# Altium schematic sheet NewPCBMC.SchDoc
size 381 x 241 mm; SheetNumber: 1; SheetTotal: 1
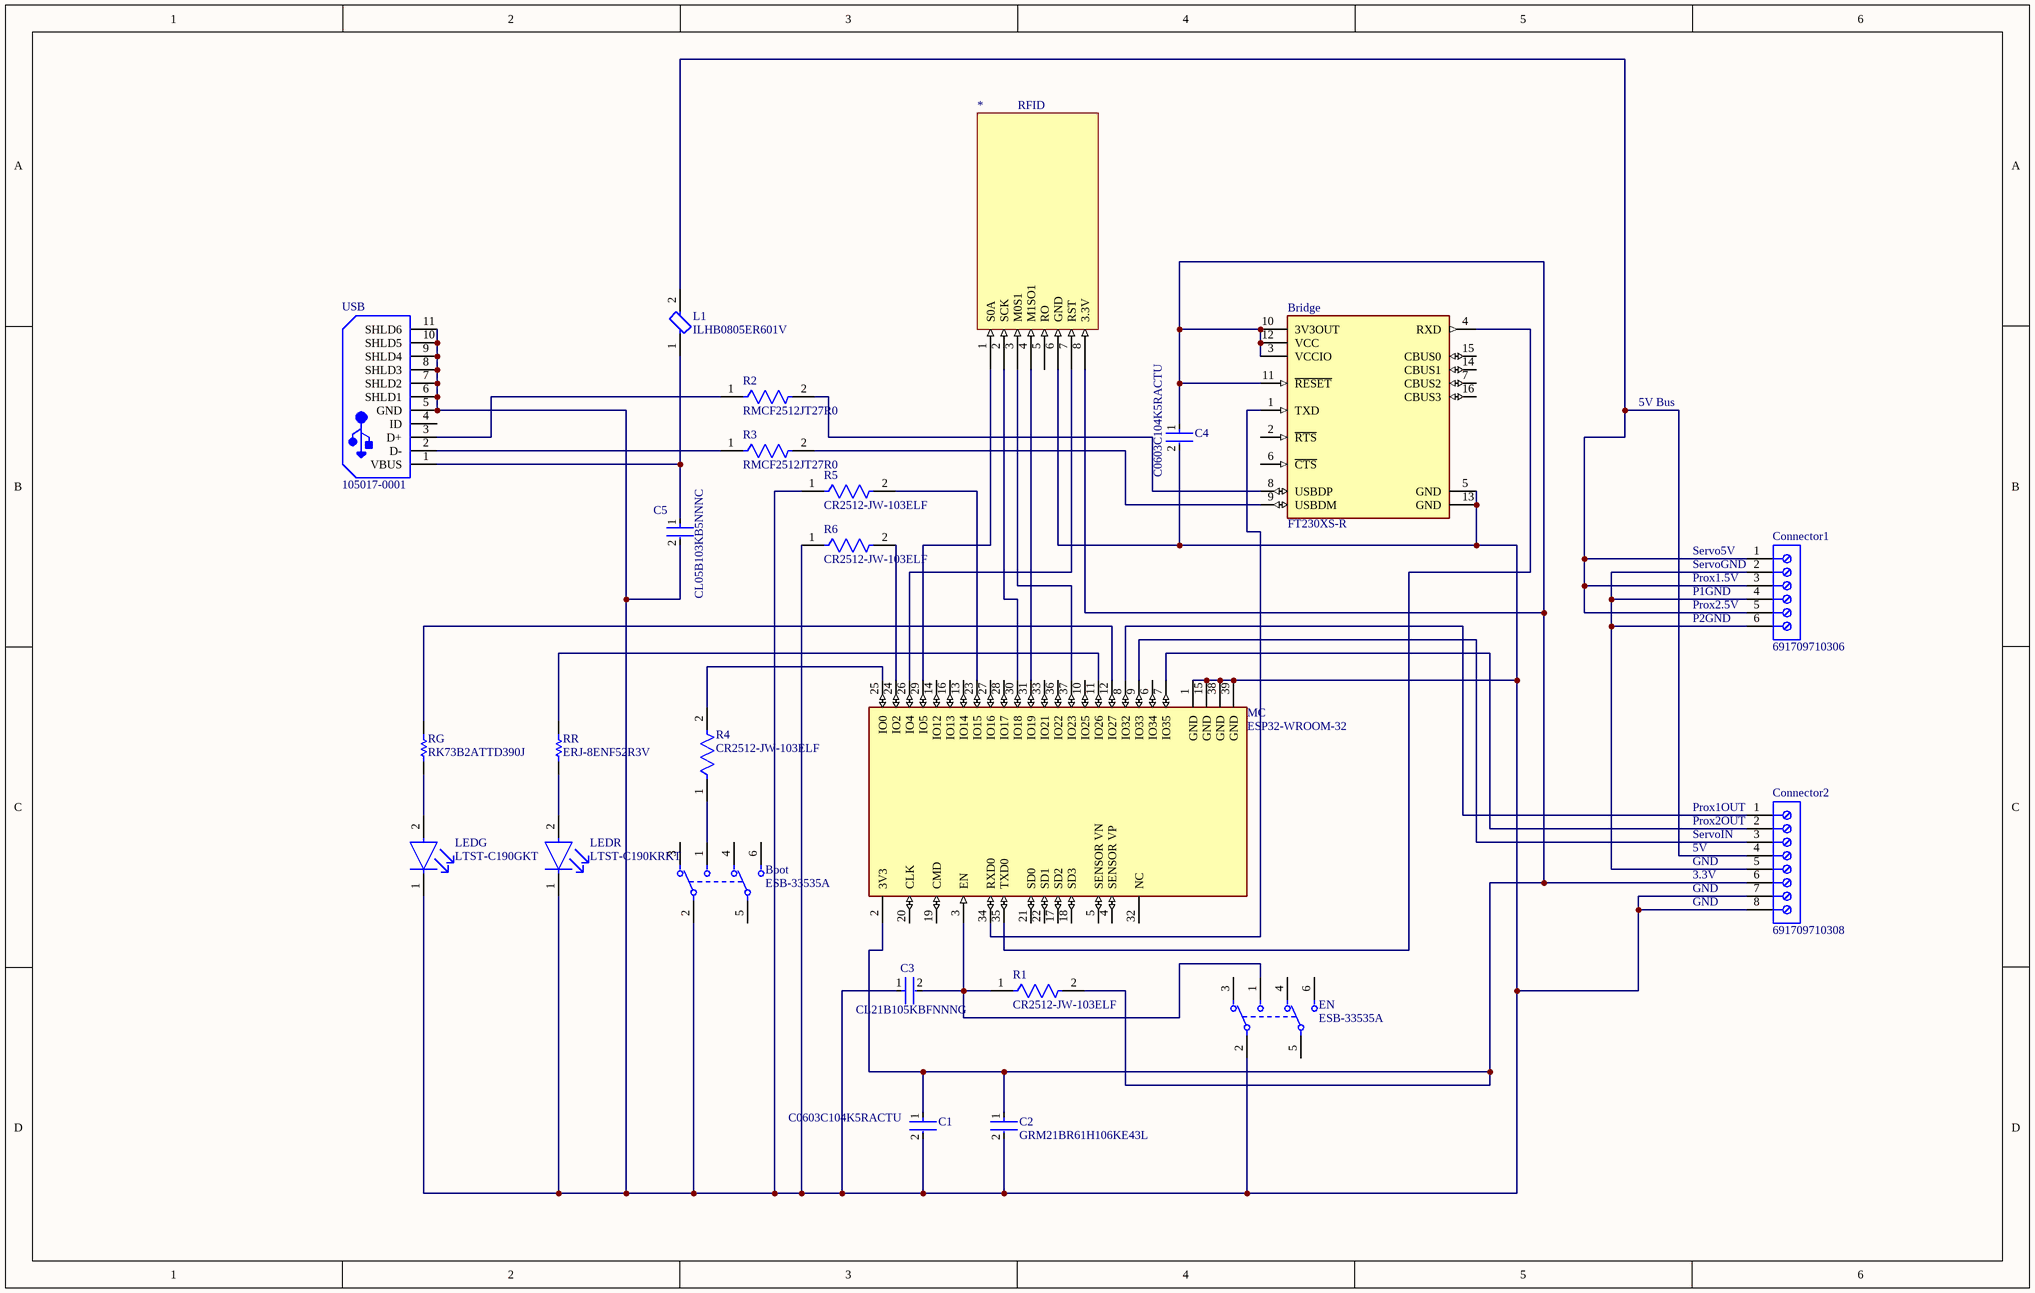
[diagram p0: NewPCBMC.SchDoc]

## Parts
*  RFID  [PCBComponent_1]
Boot  ESB-33535A  [FP-ESB-33535A-MFG]
Bridge  FT230XS-R  [FP-SSOP-16-MFG]
C1  C0603C104K5RACTU  [FP-C0603C-CF-MFG]
C2  GRM21BR61H106KE43L  [FP-GRM21B-0_2-e0_2_0_7-IPC_A]
C3  CL21B105KBFNNNG  [FP-CL21-IPC_C]
C4  C0603C104K5RACTU  [FP-C0603C-CF-MFG]
C5  CL05B103KB5NNNC  [FP-CL165-IPC_C]
Connector1  691709710306  [691709710306]
Connector2  691709710308  [691709710308]
EN  ESB-33535A  [FP-ESB-33535A-MFG]
L1  ILHB0805ER601V  [FP-ILHB-0805-IPC_C]
LEDG  LTST-C190GKT  [FP-LTST-C190GKT-MFG]
LEDR  LTST-C190KRKT  [FP-LTST-C190KRKT-MFG]
MC  ESP32-WROOM-32  [FP-ESP32-WROOM-32-MFG]
R1  CR2512-JW-103ELF  [FP-CR2512-IPC_B]
R2  RMCF2512JT27R0  [FP-RMCF2512-IPC_B]
R3  RMCF2512JT27R0  [FP-RMCF2512-IPC_B]
R4  CR2512-JW-103ELF  [FP-CR2512-IPC_B]
R5  CR2512-JW-103ELF  [FP-CR2512-IPC_B]
R6  CR2512-JW-103ELF  [FP-CR2512-IPC_B]
RG  RK73B2ATTD390J  [RESC2013X60X30ML20T20]
RR  ERJ-8ENF52R3V  [RESC3216X70X50NL05T20]
USB  105017-0001  [USB-MICRO-B_V]

## Nets
Net*_1: *.1(S0A) MC.29(IO5)
Net*_2: *.2(SCK) MC.30(IO18)
Net*_3: *.3(M0S1) MC.37(IO23)
Net*_4: *.4(M1SO1) MC.31(IO19)
Net*_6: *.6(GND) Boot.2(1_C) Bridge.5(GND) Bridge.13(GND) C1.2 C2.2 C3.1 C4.2 C5.2 Connector2.7 Connector2.8 EN.2(1_C) LEDG.1(C) LEDR.1(C) MC.1(GND) MC.15(GND) MC.38(GND) MC.39(GND) R5.1 R6.1 USB.5(GND) USB.6(SHLD1) USB.7(SHLD2) USB.8(SHLD3) USB.9(SHLD4) USB.10(SHLD5) USB.11(SHLD6)
Net*_7: *.7(RST) MC.26(IO4)
Net*_8: *.8(3.3V) Bridge.3(VCCIO) Bridge.10(3V3OUT) Bridge.11(~{RESET}) Bridge.12(VCC) C1.1 C2.1 C4.1 Connector2.6 MC.2(3V3) R1.2
NetBoot_1: Boot.1(1_N.O.) R4.1
NetBridge_1: Bridge.1(TXD) MC.34(RXD0)
NetBridge_4: Bridge.4(RXD) MC.35(TXD0)
NetBridge_8: Bridge.8(USBDP) R2.2
NetBridge_9: Bridge.9(USBDM) R3.2
NetC3_2: C3.2 EN.1(1_N.O.) MC.3(EN) R1.1
NetC5_1: C5.1 L1.1 USB.1(VBUS)
NetConnector1_1: Connector1.1 Connector1.3 Connector1.5 Connector2.4 L1.2
NetConnector1_2: Connector1.2 Connector1.4 Connector1.6 Connector2.5
NetConnector2_1: Connector2.1 MC.8(IO32)
NetConnector2_2: Connector2.2 MC.7(IO35)
NetConnector2_3: Connector2.3 MC.9(IO33)
NetLEDG_2: LEDG.2(A) RG.1
NetLEDR_2: LEDR.2(A) RR.1
NetMC_11: MC.11(IO26) RR.2
NetMC_12: MC.12(IO27) RG.2
NetMC_23: MC.23(IO15) R5.2
NetMC_24: MC.24(IO2) R6.2
NetMC_25: MC.25(IO0) R4.2
NetR2_1: R2.1 USB.3(D+)
NetR3_1: R3.1 USB.2(D-)

Not connected (* = marked no-connect by the designer): * 5(RO); Boot 3(1_N.C.) 4(2_N.C.) 5(2_C) 6(2_N.O.); Bridge 2(~{RTS}) 6(~{CTS}) 7(CBUS2) 14(CBUS1) 15(CBUS0) 16(CBUS3); EN 3(1_N.C.) 4(2_N.C.) 5(2_C) 6(2_N.O.); MC 4(SENSOR_VP) 5(SENSOR_VN) 6(IO34) 10(IO25) 13(IO14) 14(IO12) 16(IO13) 17(SD2) 18(SD3) 19(CMD) 20(CLK) 21(SD0) 22(SD1) 27(IO16) 28(IO17) 32(NC) 33(IO21) 36(IO22); USB 4(ID)

## Notes on the sheet
- 5V Bus
- (near Connector1) ServoGND
- (near Connector1) Servo5V
- (near Connector1) Prox2.5V
- (near Connector1) P2GND
- (near Connector1) P1GND
- (near Connector1) Prox1.5V
- (near Connector2) ServoIN
- (near Connector2) Prox1OUT
- (near Connector2) Prox2OUT
- 3.3V
- GND
- 5V

## Library data of the parts
* = Component_1
Boot EN = CMP-05613-000001-1: SWITCH PUSH DPDT 0.2A 14V; Radiation Hardening: No; Packaging: Tape and Reel; Termination: Solder; Throw Configuration: DPDT; Max Voltage Rating (DC): 14V; Mount: Surface Mount; Case/Package: SMD/SMT
Bridge = CMP-0248-00026-3: IC USB SERIAL BASIC UART 16SSOP; Min Supply Voltage: 2.97V; Data Rate: 12Mbps; Operating Supply Voltage: 5V; Number of Channels: 1; Max Supply Voltage: 5.5V; Operating Supply Current: 8mA; Case/Package: SSOP; Length: 5mm; Interface: UART; Mount: Surface Mount; Number of Pins: 16; Packaging: Tape and Reel; Weight: 0.004586oz; Min Operating Temperature: -40°C; Width: 0.157inch; Height: 0.059inch; Package Quantity: 3000; Max Operating Temperature: 85°C
C1 C4 = CMP-2006-03061-2: CAP CER 0.1UF 50V X7R 0603; Manufacturer: KEMET; Tolerance: 0.1; Temperature Coefficient: 30ppm/°C; Material: Ceramic; Automotive Grade: Grade 1; Value: 0.10 μF; Temperature: -55°C to +125°C; RoHS: TRUE; Temperature Range High: +125°C; Lead Free: Yes; Octopart: https://octopart.com/c0603c104k5ractu-kemet-139244; Digikey Description: CAP CER 0.1UF 50V X7R 0603; Category: Cap; Package: C0603C-CF; ComponentLink2Description: Datasheet; Temperature Range Low: -55°C; Device Class L1: Passive Components; Voltage Rating: 50 V; Automotive: Yes; Device Class L3: Ceramic Capacitors; ComponentLink2URL: https://api.kemet.com/component-edge/download/datasheet/C0603C100J5GACAUTO.pdf; Capacitance: 0.10 μF; Device Class L2: Capacitors; Manufacturer Part Number: C0603C104K5RACTU; Temperature Characteristic: X7R; Height: 0.87mm
C2 = CMP-06035-004402-1: Chip Multilayer Ceramic Capacitors for General Purpose, 0805, 10uF, X5R, 15%, 10%, 50V; Voltage Rating (DC): 50V; Dielectric: X5R; Tolerance: 10%; Capacitance: 10uF; Thickness: 1.25mm; Length: 2mm; Width: 1.25mm
C3 = CMP-13271-001433-1: CL21 Series 0805 1uF 50V ±10% Tolerance X7R Multilayer Ceramic Chip Capacitor; Case Code (Metric): 2012; Max Operating Temperature: 125°C; Termination: Wraparound; Capacitance: 1uF; Voltage: 50V; Min Operating Temperature: -55°C; Packaging: Tape and Reel; Contact Plating: Tin; Case/Package: 0805; Depth: 1.25mm; Case Code (Imperial): 0805; Mount: Surface Mount; Material: Ceramic; Tolerance: 10%; Thickness: 0.053inch; Package Quantity: 3000; Voltage Rating: 50V; Width: 0.049inch; Length: 2mm; Dielectric: X7R
C5 = CMP-13271-000387-1: Cap Ceramic 10nF 50V X7R ±10% SMD 0402 +125°C Paper T/R; Depth: 0.5mm; Length: 1mm; Lead Free: Lead Free; Case Code (Metric): 1005; Width: 0.02inch; Min Operating Temperature: -55°C; Thickness: 0.022inch; Package Quantity: 1; Mount: Surface Mount; Height: 0.5mm; Voltage: 50V; Material: Ceramic; Tolerance: 10%; Case Code (Imperial): 0402; Radiation Hardening: No; Case/Package: 0402; Max Operating Temperature: 125°C; Voltage Rating (DC): 50V; Contact Plating: Tin; Packaging: Tape and Reel; Voltage Rating: 50V; Capacitance: 10nF; Dielectric: X7R
Connector1 = CMP-1502-03339-2: NexarPartId: 34171773; Wire/Cable Gauge: 30AWG; Pitch: 5mm; Wire Gauge (Min): 14AWG; Plating: Steel; Current: 6A; Number of Levels: 1; Voltage Rating: 300V; Number of Contacts: 6; Connector Type: Screw; Flammability Rating: UL94 V-0; Housing Material: Nylon; REACH SVHC: Unknown; Lead Pitch: 5mm; Contact Plating: Tin; Mount: Surface Mount; Height: 10.2mm; Number of Rows: 1; Min Operating Temperature: -40°C; RoHS: Compliant; Color: Black; Contact Material: Nickel; Wire Gauge (Max): 30AWG; Number of Pins: 6; Length: 30mm; Number of Positions: 6; Packaging: Tape & Reel (TR); Number of Positions Per Level: 6; Max Operating Temperature: 130°C; Termination: Screw; Current Rating: 6A; Voltage: 300V
Connector2 = CMP-1502-03340-2: NexarPartId: 34171774; Voltage Rating: 300V; Number of Positions: 8; Number of Levels: 1; Wire Gauge (Min): 14AWG; Current Rating: 6A; Wire Gauge (Max): 30AWG; Plating: Steel; Connector Type: Screw; Pitch: 5mm; Packaging: Tape & Reel (TR); Length: 40mm; Max Operating Temperature: 130°C; Number of Contacts: 8; Number of Pins: 8; Flammability Rating: UL94 V-0; Termination: Screw; Color: Black; Min Operating Temperature: -40°C; Current: 6A; Number of Positions Per Level: 8; RoHS: Compliant; Voltage: 300V; Housing Material: Nylon; Mount: Surface Mount; REACH SVHC: Unknown; Lead Pitch: 5mm; Contact Plating: Tin; Wire/Cable Gauge: 30AWG
L1 = CMP-02428-000001-1: FERRITE BEAD 600 OHM 0805 1LN; Manufacturer: Vishay; Tolerance: 25%; Shielding: true; Test Frequency: 100MHz; Impedance At Frequency: 600Ω @ 100MHz; Series Resistance: 0.1Ω; Rms Current: 2000mA; ComponentLink2URL: http://www.vishay.com/docs/34102/ilhb.pdf; Octopart: https://octopart.com/ilhb0805er601v-vishay-39650184; Automotive: No; Height: 1.1mm; Mouser Description: Ferrite Beads Multi-Layer High Current 600Ohm 25% 100MHz 2A 100mOhm DCR 0805 T/R; ComponentLink2Description: Datasheet; Device Class L2: EMI / RFI Components; Lead Free: Yes; Ipc Land Pattern Name: CAPC200125X90; Package: ILHB-0805; Manufacturer Part Number: ILHB0805ER601V; Device Class L1: Passive Components; Digikey Description: FERRITE BEAD 600 OHM 0805 1LN; Category: FBead; Temperature Range High: +125°C; Temperature: -55°C to +125°C; RoHS: TRUE; Temperature Range Low: -55°C; Device Class L3: Ferrite Beads and Chips
LEDG = CMP-22017-000005-2: LED GREEN CLEAR CHIP SMD; Dominant Wavelength: 569nm; Reverse Voltage: 5V; Lens Color: Colorless; Viewing Angle: 130°; Voltage: 2V; Forward Current: 30mA; Power Dissipation: 100mW; Luminous Intensity: 6mcd; Number of LEDs: 1; Forward Voltage: 2.1V; Wavelength: 565nm; Test Current: 10mA; Min Operating Temperature: -55°C; Lens Style: Clear; Mount: Surface Mount; Width: 0.8mm; Packaging: Tape and Reel; Lens Transparency: Clear; Case Code (Metric): 1608; Depth: 0.8mm; Case Code (Imperial): 0603; Case/Package: 0603; Number of Pins: 2; Max Operating Temperature: 85°C; Lead Free: Lead Free; Number of Elements: 1; Length: 1.6mm; Height: 0.8mm; Package Quantity: 1; Power Rating: 100mW; Radiation Hardening: No; Illumination Color: Green; Color: Green
LEDR = CMP-1674-00011-2: LED RED CLEAR CHIP SMD; Reverse Voltage: 5V; Viewing Angle: 130°; Power Rating: 75mW; Test Current: 20mA; Number of Elements: 1; Lens Color: Colorless; Wavelength: 639nm; Dominant Wavelength: 631nm; Lens Style: Diffused; Forward Current: 30mA; Forward Voltage: 2.4V; Luminous Intensity: 54mcd; Color: Red; Case Code (Imperial): 0603; Lens Transparency: Clear; Lead Free: Lead Free; Package Quantity: 1; Packaging: Tape and Reel; Max Operating Temperature: 85°C; Number of Pins: 2; Height: 0.8mm; Case/Package: 0603; Number of LEDs: 1; Width: 0.8mm; Case Code (Metric): 1608; Depth: 0.8mm; Mount: Surface Mount; Radiation Hardening: No; Length: 1.6mm; Illumination Color: Red; Power Dissipation: 75mW; Min Operating Temperature: -55°C
MC = CMP-194065-000008-1: RX TXRX MOD WIFI SURFACE MOUNT; Frequency: 2.5GHz; Sensitivity: -98dBm; Operating Supply Voltage: 3.6V; Data Rate: 150Mbps; Weight: 0.088185oz; Package Quantity: 550; Min Operating Temperature: -40°C; Mount: Surface Mount; Max Operating Temperature: 85°C; Packaging: Cut Tape; Case/Package: SMD/SMT
R1 R4-R6 = CMP-1018-00098-2: Thick Film Chip Resistors 2512 10kΩ 1W 5% 200ppm/°C; Resistance: 10kR; Voltage Rating: 200V; Max Power Dissipation: 1W; Height: 0.03inch; Max Operating Temperature: 155°C; Width: 0.122inch; Packaging: Tape and Reel; Length: 6.3mm; Case Code (Metric): 6332; Temperature Coefficient: 200ppm/°C; Mount: Surface Mount; Radiation Hardening: No; Contact Plating: Tin; Power Rating: 1W; Weight: 0.001429oz; Case Code (Imperial): 2512; Number of Terminations: 2; Min Operating Temperature: -55°C; Package Quantity: 4000; Depth: 3.1mm; Termination: SMD/SMT; Composition: Thick Film; Military Standard: Not; Tolerance: 5%; Case/Package: 2512
R2 R3 = CMP-26527-001789-1: 27Ω ±5% 1W 2512 Thick Film Chip Resistor AEC-Q200 compliant; Temperature Coefficient: 100ppm/°C; Resistance: 27R; Max Power Dissipation: 1W; Construction: Rectangular; Case Code (Metric): 6432; Tolerance: 5%; Number of Terminations: 2; Case Code (Imperial): 2512; Packaging: Tape and Reel; Min Operating Temperature: -55°C; Power Rating: 1W; Mount: Surface Mount; Radiation Hardening: No; Features: Automotive AEC-Q200; Length: 0.248inch; Width: 0.126inch; Military Standard: Not; Size Code: 2512; RoHS Compliant: Yes; Case/Package: 2512; Lead Free: Lead Free; Depth: 3.2mm; Resistor Type: Thick Film; Series: RMCF; Package Quantity: 4000; Height: 0.028inch; Contact Plating: Tin; Max Operating Temperature: 155°C
RG = CMP-2001-04588-1: Manufacturer: KOA Speer; Part Number: RK73B2ATTD390J
RR = CMP-2003-00414-1: Manufacturer: Panasonic; Part Number: ERJ-8ENF52R3V
USB = CMP-2000-05827-1: Micro-USB B Receptacle, Right Angle, Bottom Mount, Surface Mount, with Solder Tabs, -30 to 85 degC, 5-Pin USB, RoHS, Tape and Reel; Manufacturer: Molex; Featured Product: Micro-USBConnectorsUSBConnectors; Other Names: WM1399DKR; Package Version: Rev. F, 12/2012; Number of Contacts: 5; Connector Type: USB-microB; Catalog Drawings: 1050170001; 3D Model: 105017-0001.stp; Mating Products: WM17145-ND-CABLEMICROUSBBTOSTDA1.0MWM17147-ND-CABLEMICROUSBBTOSTDA2.0MWM17146-ND-CABLEMICROUSBBTOSTDA1.5M; PCN Assembly/Origin: ResinSupplier21/Oct/2015; Voltage - Max: 30V; Online Catalog: Molex-MicroUSB; Manufacturer URL: http://www.molex.com/; Package Description: 5-Leads USB, Micro B, Body 7.5 x 5 mm, Pitch 0.65 mm; Datasheet URL: http://www.molex.com/elqNow/elqRedir.htm?ref=http://www.molex.com/webdocs/datasheets/pdf/en-us/1050170001_IO_CONNECTORS.pdf; Ingress Protection: -; Datasheet Version: 03/2016; Mounting Type: BoardCutout,SurfaceMount,RightAngle; Circuits: 5; Standard Package: 1; Package Reference: MICRO-B; Package URL: http://www.molex.com/pdm_docs/sd/1050170001_sd.pdf; Category: Connectors,Interconnects; Series: -; RoHS Information: 1050170001CertofCompliance; Features: Shielded,SolderRetention; Family: USB,DVI,HDMIConnectors; Specifications: -; Gender: Receptacle; Packaging: Digi-Reel®; Mounting Technology: SurfaceMount